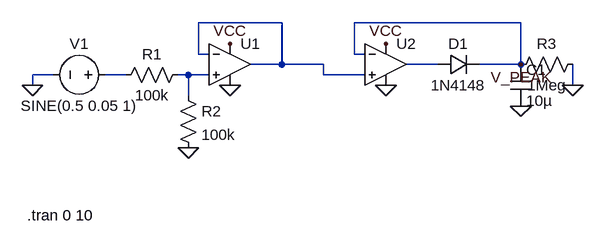
[diagram p0: schematic peak detector LTSpice.asc]
peak detector LTSpice.asc, the LTspice schematic file:
Version 4
SHEET 1 880 680
WIRE 288 112 160 112
WIRE 656 112 400 112
WIRE 160 160 160 112
WIRE 176 160 160 160
WIRE 400 160 400 112
WIRE 416 160 400 160
WIRE 288 176 288 112
WIRE 288 176 240 176
WIRE 352 176 288 176
WIRE 528 176 480 176
WIRE 656 176 656 112
WIRE 656 176 592 176
WIRE -64 192 -96 192
WIRE 48 192 16 192
WIRE 144 192 128 192
WIRE 176 192 144 192
WIRE 352 192 352 176
WIRE 416 192 352 192
WIRE -96 208 -96 192
WIRE 736 208 736 176
WIRE 144 224 144 192
FLAG 144 304 0
FLAG 208 208 0
FLAG 448 208 0
FLAG 656 240 0
FLAG 736 208 0
FLAG -96 208 0
FLAG 656 176 V_PEAK
FLAG 208 144 VCC
FLAG 448 144 VCC
SYMBOL OpAmps/UniversalOpAmp 208 176 R0
SYMATTR InstName U1
SYMBOL OpAmps/UniversalOpAmp 448 176 R0
SYMATTR InstName U2
SYMBOL Voltage 32 192 R90
WINDOW 0 -32 56 VBottom 2
WINDOW 3 32 56 VTop 2
SYMATTR InstName V1
SYMATTR Value SINE(0.5 0.05 1)
SYMBOL Res 144 176 R90
WINDOW 0 0 56 VBottom 2
WINDOW 3 32 56 VTop 2
SYMATTR InstName R1
SYMATTR Value 100k
SYMBOL Res 128 208 R0
SYMATTR InstName R2
SYMATTR Value 100k
SYMBOL diode 528 192 R270
WINDOW 0 32 32 VTop 2
WINDOW 3 0 32 VBottom 2
SYMATTR InstName D1
SYMATTR Value 1N4148
SYMBOL Cap 640 176 R0
SYMATTR InstName C1
SYMATTR Value 10µ
SYMBOL Res 752 160 R90
WINDOW 0 0 56 VBottom 2
WINDOW 3 32 56 VTop 2
SYMATTR InstName R3
SYMATTR Value 1Meg
TEXT -104 408 Left 2 !.tran 0 10

The netlist it stands for:
* peak detector LTSpice.asc
XU1 N004 N001 VCC 0 N001 level1 Avol=1Meg GBW=10Meg Vos=0 En=0 Enk=0 In=0 Ink=0 Rin=500Meg  ; pins In+ In- V+ V- OUT
XU2 N001 V_PEAK VCC 0 N002 level1 Avol=1Meg GBW=10Meg Vos=0 En=0 Enk=0 In=0 Ink=0 Rin=500Meg  ; pins In+ In- V+ V- OUT
V1 N003 0 SINE(0.5 0.05 1)
R1 N004 N003 100k
R2 N004 0 100k
D1 N002 V_PEAK 1N4148
C1 V_PEAK 0 10µ
R3 0 V_PEAK 1Meg
.model D D
.lib standard.dio
.tran 0 10
.lib UniversalOpAmp1.lib
.backanno
.end